# Altium schematic sheet ESC_altimeter_v01.SchDoc
size A3; SheetNumber: 1; SheetTotal: 1
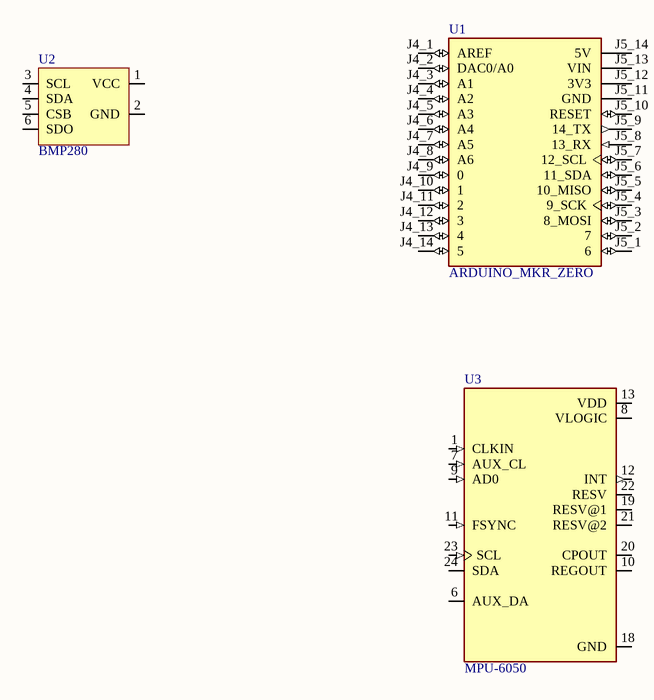
[diagram p0: ESC_altimeter_v01.SchDoc]

## Parts
U1  ARDUINO_MKR_ZERO  [MODULE_ARDUINO_MKR_ZERO]
U2  BMP280  [BMP280]
U3  MPU-6050  [QFN50P400X400X95-24N]

## Nets

Not connected (* = marked no-connect by the designer): U1 J4_1(AREF) J4_2(DAC0/A0) J4_3(A1) J4_4(A2) J4_5(A3) J4_6(A4) J4_7(A5) J4_8(A6) J4_9(0) J4_10(1) J4_11(2) J4_12(3) J4_13(4) J4_14(5) J5_1(6) J5_2(7) J5_3(8_MOSI) J5_4(9_SCK) J5_5(10_MISO) J5_6(11_SDA) J5_7(12_SCL) J5_8(13_RX) J5_9(14_TX) J5_10(RESET) J5_11(GND) J5_12(3V3) J5_13(VIN) J5_14(5V); U2 1(VCC) 2(GND) 3(SCL) 4(SDA) 5(CSB) 6(SDO); U3 1(CLKIN) 6(AUX_DA) 7(AUX_CL) 8(VLOGIC) 9(AD0) 10(REGOUT) 11(FSYNC) 12(INT) 13(VDD) 18(GND) 19(RESV@1) 20(CPOUT) 21(RESV@2) 22(RESV) 23(SCL) 24(SDA)

## Library data of the parts
U1 = ARDUINO_MKR_ZERO: ATSAMD21 Arduino MKR Zero with Headers SAM D ARMÂ® CortexÂ®-M0+ MCU 32-Bit Embedded Evaluation Board; Availability: Unavailable; Check_prices: https://www.snapeda.com/parts/ARDUINO%20MKR%20ZERO/Arduino/view-part/2709581/?ref=eda; SnapEDA_Link: https://www.snapeda.com/parts/ARDUINO%20MKR%20ZERO/Arduino/view-part/2709581/?ref=snap; MF: Arduino; Value: *; Price: None; Package: None; MP: ARDUINO MKR ZERO
U3 = MPU-6050: MPU-6050 Six-Axis (Gyro + Accelerometer) MEMS MotionTrackingâ„¢ Devices; MF: {'manufacturer': u'TDK InvenSense'}; Package: None; Price: None; Value: *; MP: MPU-6050; Availability: Unavailable